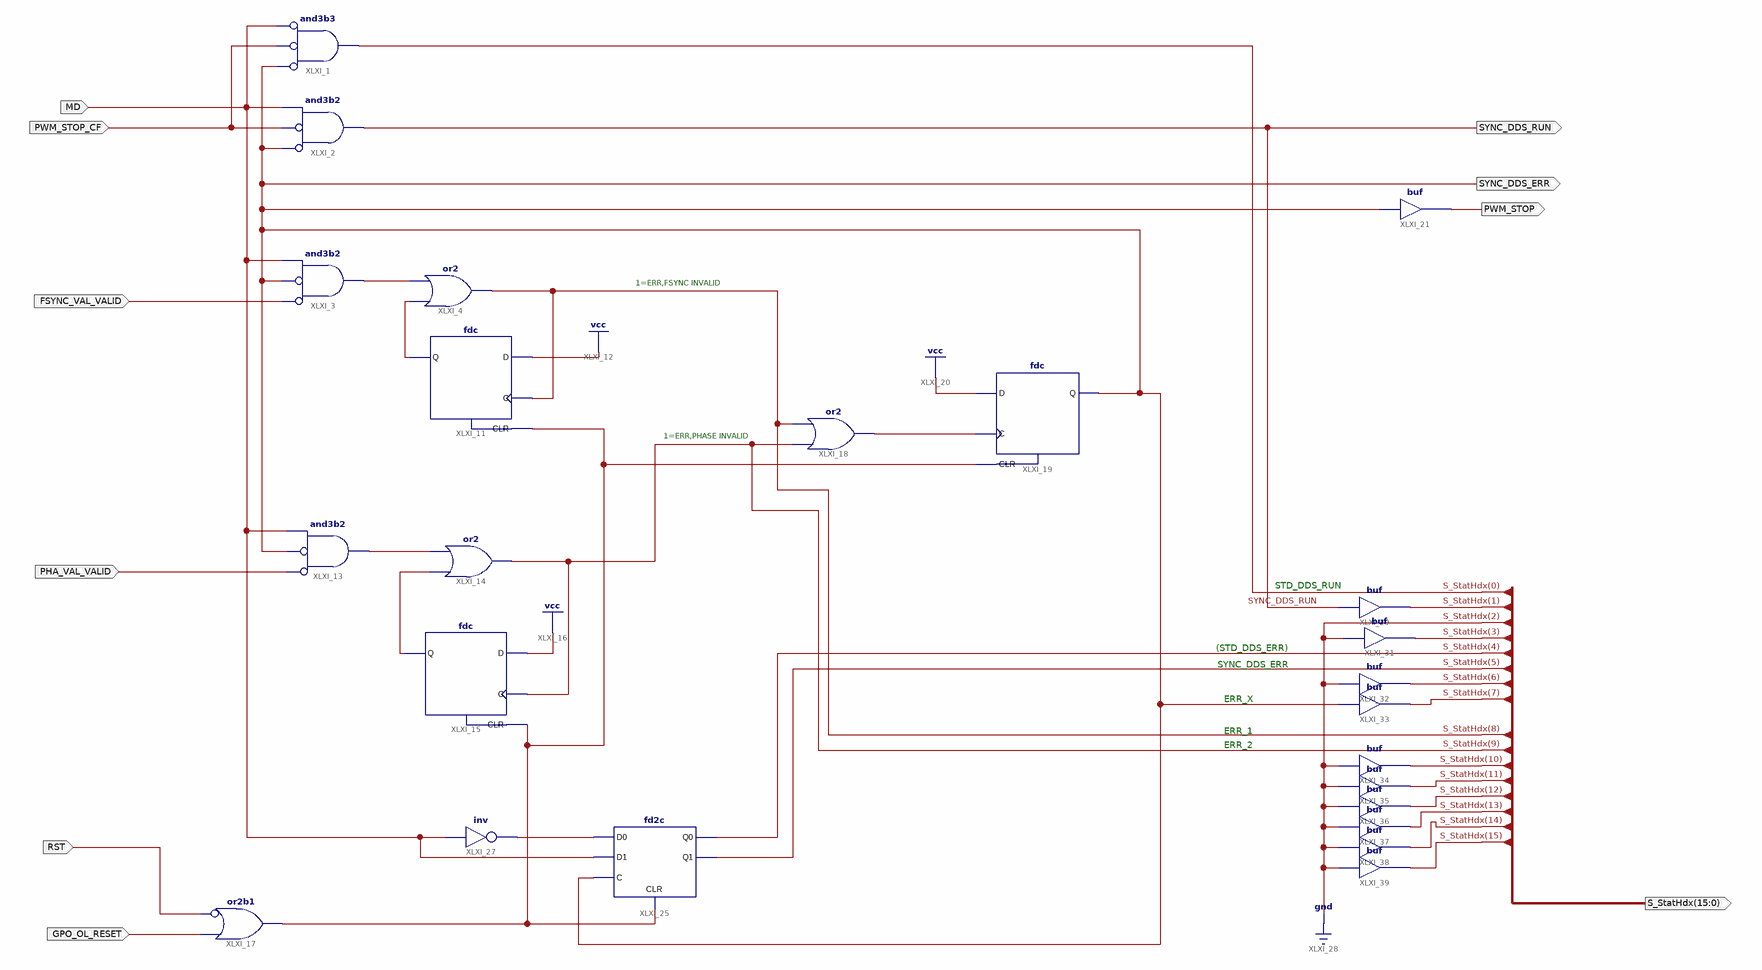
[diagram p0: schematic sheet 1]
// Xilinx ISE schematic ERRSTAT.sch (spartan3a) as structural Verilog: 24 symbols, 10 ports
module ERRSTAT (
  input  MD,
  input  PWM_STOP_CF,
  input  FSYNC_VAL_VALID,
  input  PHA_VAL_VALID,
  input  GPO_OL_RESET,
  input  RST,
  output SYNC_DDS_ERR,
  output SYNC_DDS_RUN,
  output PWM_STOP,
  output [15:0] S_StatHdx
);

  wire XLXN_3, XLXN_4, XLXN_15, XLXN_16, XLXN_23, XLXN_28, XLXN_36;

  and XLXI_1 (S_StatHdx[0], ~SYNC_DDS_ERR, ~PWM_STOP_CF, ~MD);  // and3b3
  and XLXI_2 (SYNC_DDS_RUN, ~SYNC_DDS_ERR, ~PWM_STOP_CF, MD);  // and3b2
  and XLXI_3 (XLXN_4, ~FSYNC_VAL_VALID, ~SYNC_DDS_ERR, MD);  // and3b2
  or XLXI_4 (S_StatHdx[8], XLXN_3, XLXN_4);
  fdc XLXI_11 (.C(S_StatHdx[8]), .CLR(XLXN_23), .D(1'b1), .Q(XLXN_3));
  and XLXI_13 (XLXN_16, ~PHA_VAL_VALID, ~SYNC_DDS_ERR, MD);  // and3b2
  or XLXI_14 (S_StatHdx[9], XLXN_15, XLXN_16);
  fdc XLXI_15 (.C(S_StatHdx[9]), .CLR(XLXN_23), .D(1'b1), .Q(XLXN_15));
  or XLXI_17 (XLXN_23, ~RST, GPO_OL_RESET);  // or2b1
  or XLXI_18 (XLXN_28, S_StatHdx[9], S_StatHdx[8]);
  fdc XLXI_19 (.C(XLXN_28), .CLR(XLXN_23), .D(1'b1), .Q(SYNC_DDS_ERR));
  buf XLXI_21 (PWM_STOP, SYNC_DDS_ERR);
  fd2c XLXI_25 (.D0(XLXN_36), .D1(MD), .C(SYNC_DDS_ERR), .Q0(S_StatHdx[4]), .Q1(S_StatHdx[5]), .CLR(XLXN_23));
  not XLXI_27 (XLXN_36, MD);
  buf XLXI_29 (S_StatHdx[1], SYNC_DDS_RUN);
  buf XLXI_31 (S_StatHdx[3], 1'b0);
  buf XLXI_32 (S_StatHdx[6], 1'b0);
  buf XLXI_33 (S_StatHdx[7], SYNC_DDS_ERR);
  buf XLXI_34 (S_StatHdx[10], 1'b0);
  buf XLXI_35 (S_StatHdx[11], 1'b0);
  buf XLXI_36 (S_StatHdx[12], 1'b0);
  buf XLXI_37 (S_StatHdx[13], 1'b0);
  buf XLXI_38 (S_StatHdx[14], 1'b0);
  buf XLXI_39 (S_StatHdx[15], 1'b0);

  assign S_StatHdx[2] = 1'b0;

  // Notes on the sheet:
  //   1=ERR,FSYNC INVALID
  //   1=ERR,PHASE INVALID
  //   STD_DDS_RUN
  //   (STD_DDS_ERR)
  //   SYNC_DDS_ERR
  //   ERR_X
  //   ERR_1
  //   ERR_2
endmodule
